# EasyEDA schematic stars.json
TITLE: Sheet_1; REV: 1.0; Date: 2022-06-15; Sheet: 1/1; Company: Your Company
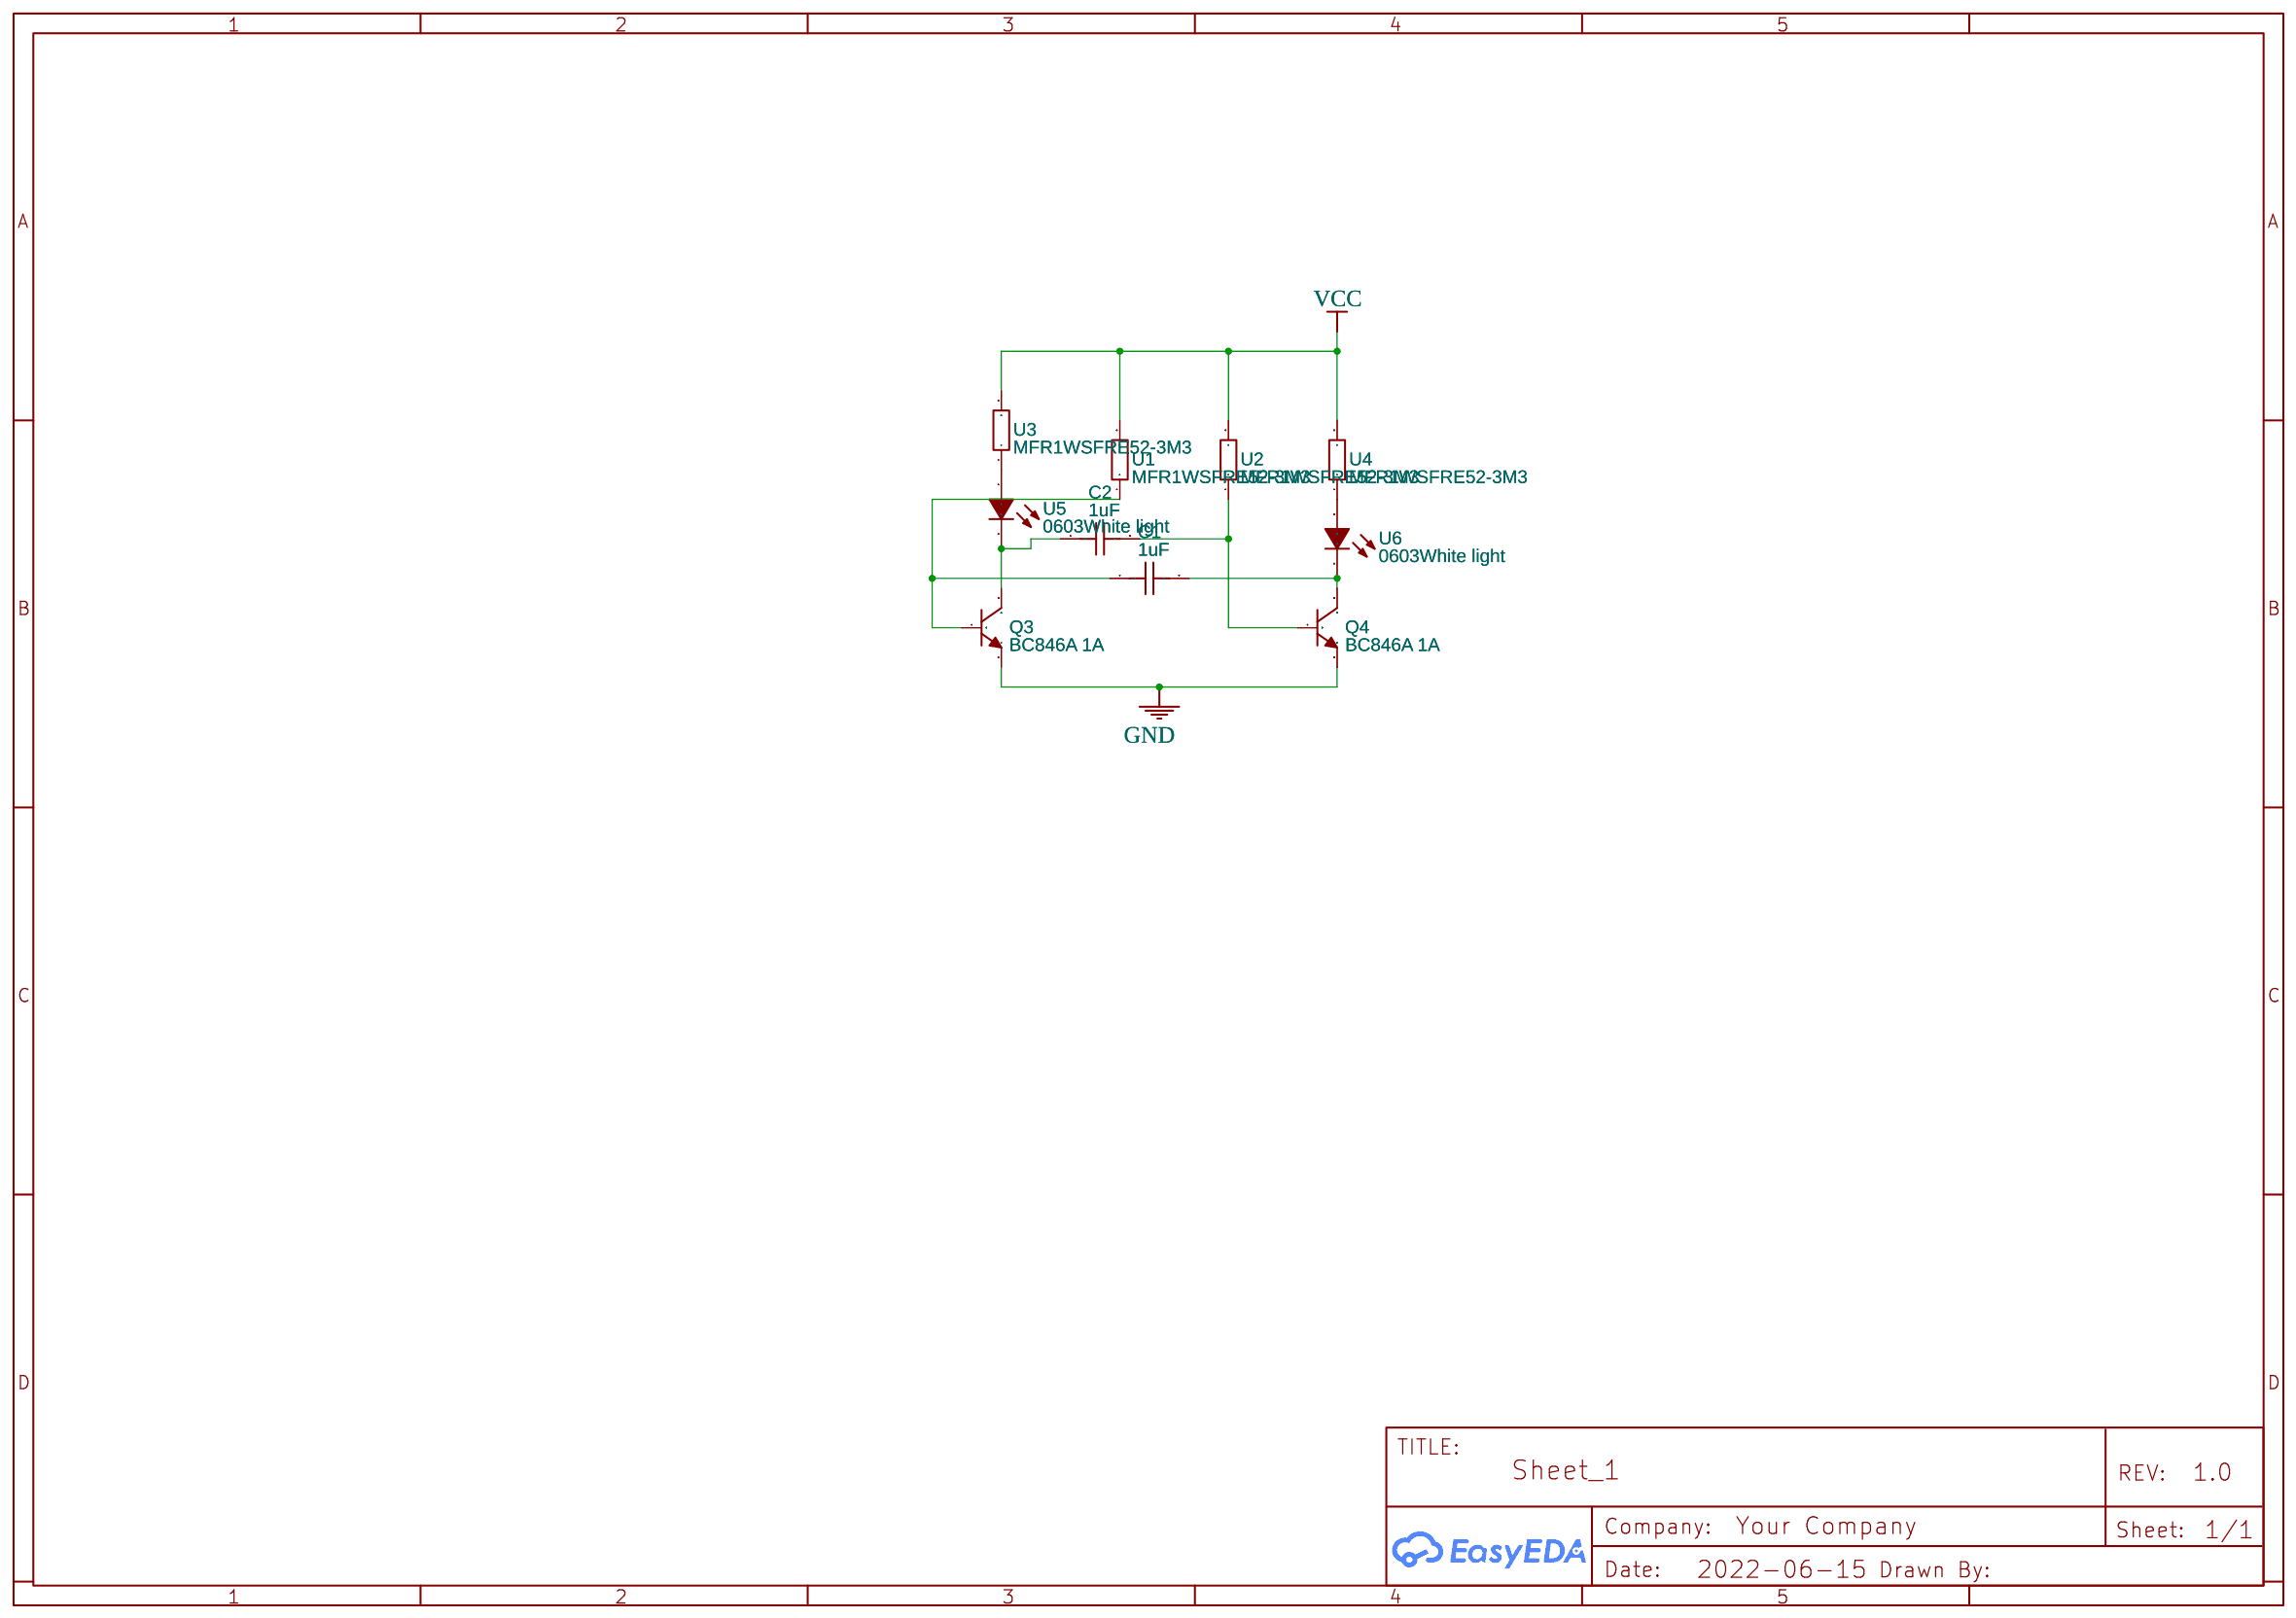
[diagram p0: schematic sheet]

## Parts
C1  1uF  [CAP-TH_L5.5-W3.5-P5.00-D1.2]
C2  1uF  [CAP-TH_L5.5-W3.5-P5.00-D1.2]
Q3  BC846A 1A  [SOT-23-3_L2.9-W1.3-P1.90-LS2.4]
Q4  BC846A 1A  [SOT-23-3_L2.9-W1.3-P1.90-LS2.4]
U1  MFR1WSFRE52-3M3  [RES-TH_BD3.3-L9.0-P13.00-D0.6]
U2  MFR1WSFRE52-3M3  [RES-TH_BD3.3-L9.0-P13.00-D0.6]
U3  MFR1WSFRE52-3M3  [RES-TH_BD3.3-L9.0-P13.00-D0.6]
U4  MFR1WSFRE52-3M3  [RES-TH_BD3.3-L9.0-P13.00-D0.6]
U5  0603White light  [LED0603-FD]
U6  0603White light  [LED0603-FD]

## Library data of the parts
C1 C2 = FK26X7R1H105KRE06: Supplier: LCSC; Supplier Part: C2839237; Manufacturer: TDK; Contributor: LCSC; JLCPCB Part Class: Extended Part
Q3 Q4 = BC846A 1A: Supplier: LCSC; Supplier Part: C2919760; Manufacturer: CBI(创基); Contributor: LCSC; JLCPCB Part Class: Extended Part
U1-U4 = MFR1WSFRE52-3M3: Supplier: LCSC; Supplier Part: C1760327; Manufacturer: YAGEO(国巨); link: https://atta.szlcsc.com/upload/public/pdf/source/20201029/C911418_CEA09B7112BCFF5AE38F343DDB8D42E7.pdf; Resistance: 3.3MΩ; Contributor: lcsc
U5 U6 = 0603White light: Supplier: LCSC; Manufacturer: ReliaPro; Supplier Part: C113679

## Nets
GND: Q3.2(E) Q4.2(E)
VCC: U1.2 U2.2 U3.2 U4.2
Net-(C1-1): C1.1 Q3.1(B) U1.1
Net-(C1-2): C1.2 Q4.3(C) U6.2(K)
Net-(C2-1): C2.1 Q3.3(C) U5.2(K)
Net-(C2-2): C2.2 Q4.1(B) U2.1
Net-(U3-1): U3.1 U5.1(A)
Net-(U4-1): U4.1 U6.1(A)
